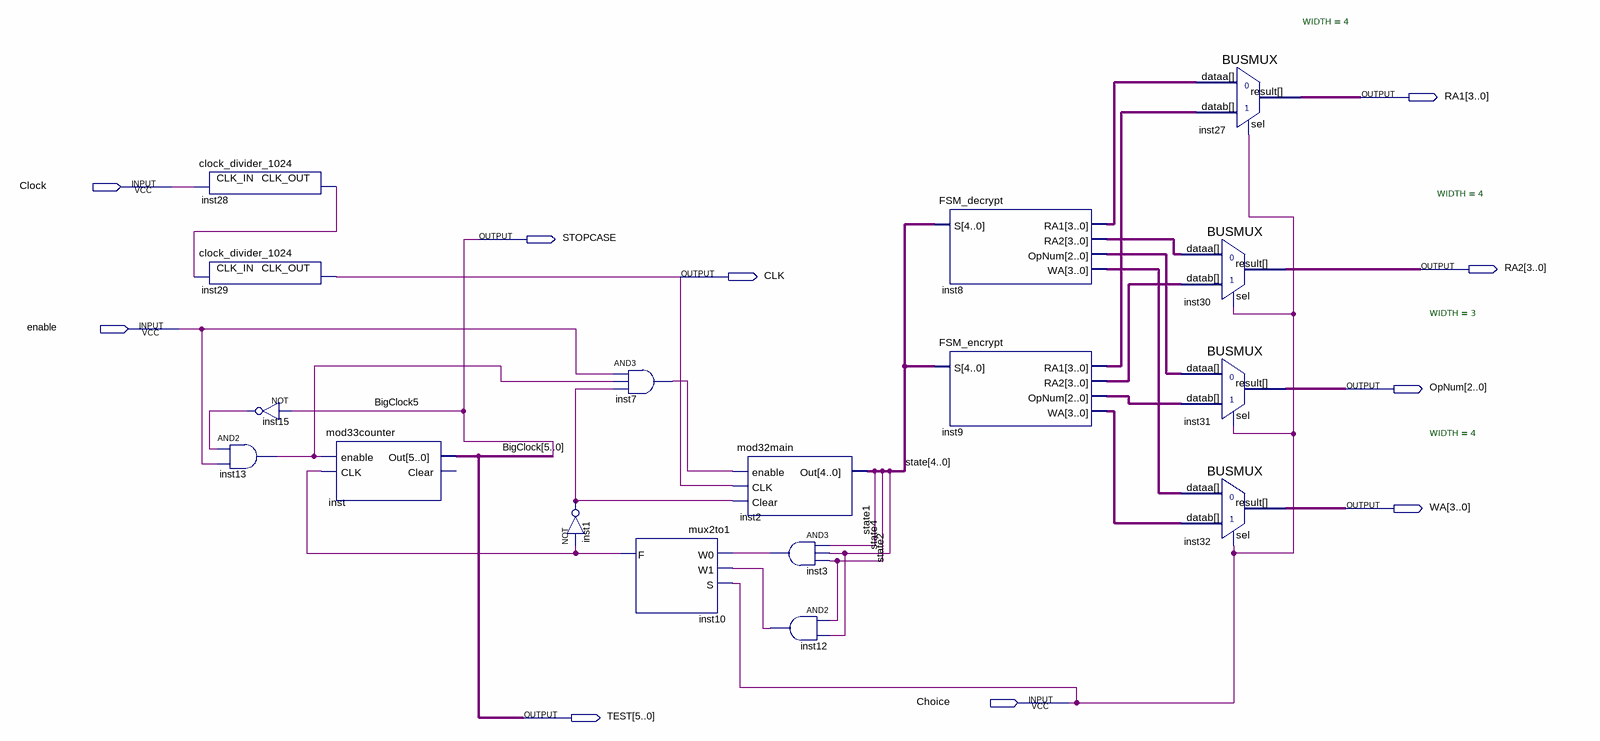
[diagram p0: schematic sheet]
// Quartus schematic ALUBlock.bdf as structural Verilog: 17 symbols, 10 pins
module ALUBlock (
  input  Clock,
  input  enable,
  input  Choice,
  output [3:0] RA1,
  output STOPCASE,
  output [3:0] RA2,
  output CLK,
  output [2:0] OpNum,
  output [3:0] WA,
  output [5:0] TEST
);

  wire inst1_out, inst3_out, inst7_out, inst10_f, inst12_out, inst13_out, inst15_out, inst28_clk_out;
  wire [2:0] inst8_opnum, inst9_opnum;
  wire [3:0] inst8_ra1, inst8_ra2, inst8_wa, inst9_ra1, inst9_ra2, inst9_wa;
  wire [4:0] state;

  clock_divider_1024 inst28 (.CLK_IN(Clock), .CLK_OUT(inst28_clk_out));
  clock_divider_1024 inst29 (.CLK_IN(inst28_clk_out), .CLK_OUT(CLK));
  and inst13 (inst13_out, inst15_out, enable);
  not inst15 (inst15_out, STOPCASE);
  mod33counter inst (.enable(inst13_out), .CLK(inst10_f), .Out({STOPCASE, TEST[4:0]}));  // open: Clear
  not inst1 (inst1_out, inst10_f);
  and inst7 (inst7_out, enable, inst13_out, inst1_out);
  mux2to1 inst10 (.W0(inst3_out), .W1(inst12_out), .S(Choice), .F(inst10_f));
  mod32main inst2 (.enable(inst7_out), .CLK(CLK), .Clear(inst1_out), .Out(state));
  and inst3 (inst3_out, state[1], state[2], state[4]);
  and inst12 (inst12_out, state[4], state[2]);
  FSM_decrypt inst8 (.S(state), .RA1(inst8_ra1), .RA2(inst8_ra2), .OpNum(inst8_opnum), .WA(inst8_wa));
  FSM_encrypt inst9 (.S(state), .RA1(inst9_ra1), .RA2(inst9_ra2), .OpNum(inst9_opnum), .WA(inst9_wa));
  BUSMUX #(.WIDTH(4)) inst27 (.datab(inst9_ra1), .sel(Choice), .dataa(inst8_ra1), .result(RA1));
  BUSMUX #(.WIDTH(4)) inst30 (.datab(inst9_ra2), .sel(Choice), .dataa(inst8_ra2), .result(RA2));
  BUSMUX #(.WIDTH(3)) inst31 (.datab(inst9_opnum), .sel(Choice), .dataa(inst8_opnum), .result(OpNum));
  BUSMUX #(.WIDTH(4)) inst32 (.datab(inst9_wa), .sel(Choice), .dataa(inst8_wa), .result(WA));

  assign TEST[5] = STOPCASE;

  // Other names for the same wires on the sheet: BigClock[5:0] = {STOPCASE, TEST[4:0]}; BigClock5 = STOPCASE
endmodule
